# EAGLE schematic source_eagle (EAGLE 9.6.2)
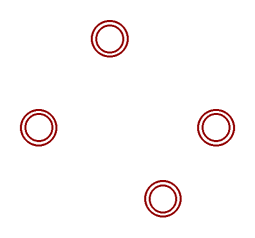
[diagram p0: schematic, sheet 1]

## Parts
U$1  MOUNTINGHOLE3.0THIN  [MOUNTINGHOLE_3.0_PLATEDTHIN]
U$2  MOUNTINGHOLE3.0THIN  [MOUNTINGHOLE_3.0_PLATEDTHIN]
U$3  MOUNTINGHOLE3.0THIN  [MOUNTINGHOLE_3.0_PLATEDTHIN]
U$4  MOUNTINGHOLE3.0THIN  [MOUNTINGHOLE_3.0_PLATEDTHIN]

## Library data of the parts
U$1-U$4 = adafruit_electromech:MOUNTINGHOLE: Mounting Hole For #2 screws (0.086"/2.18mm width, 0.094"/2.4mm hole) use 2.5mm; BOM: EXCLUDE

## Net classes
3 Power: width 0.305 mm, drill 0.483 mm
4 LOWPOWER: width 0.254 mm